# Altium schematic sheet 1.POWER2.5.SchDoc
size 431 x 304 mm
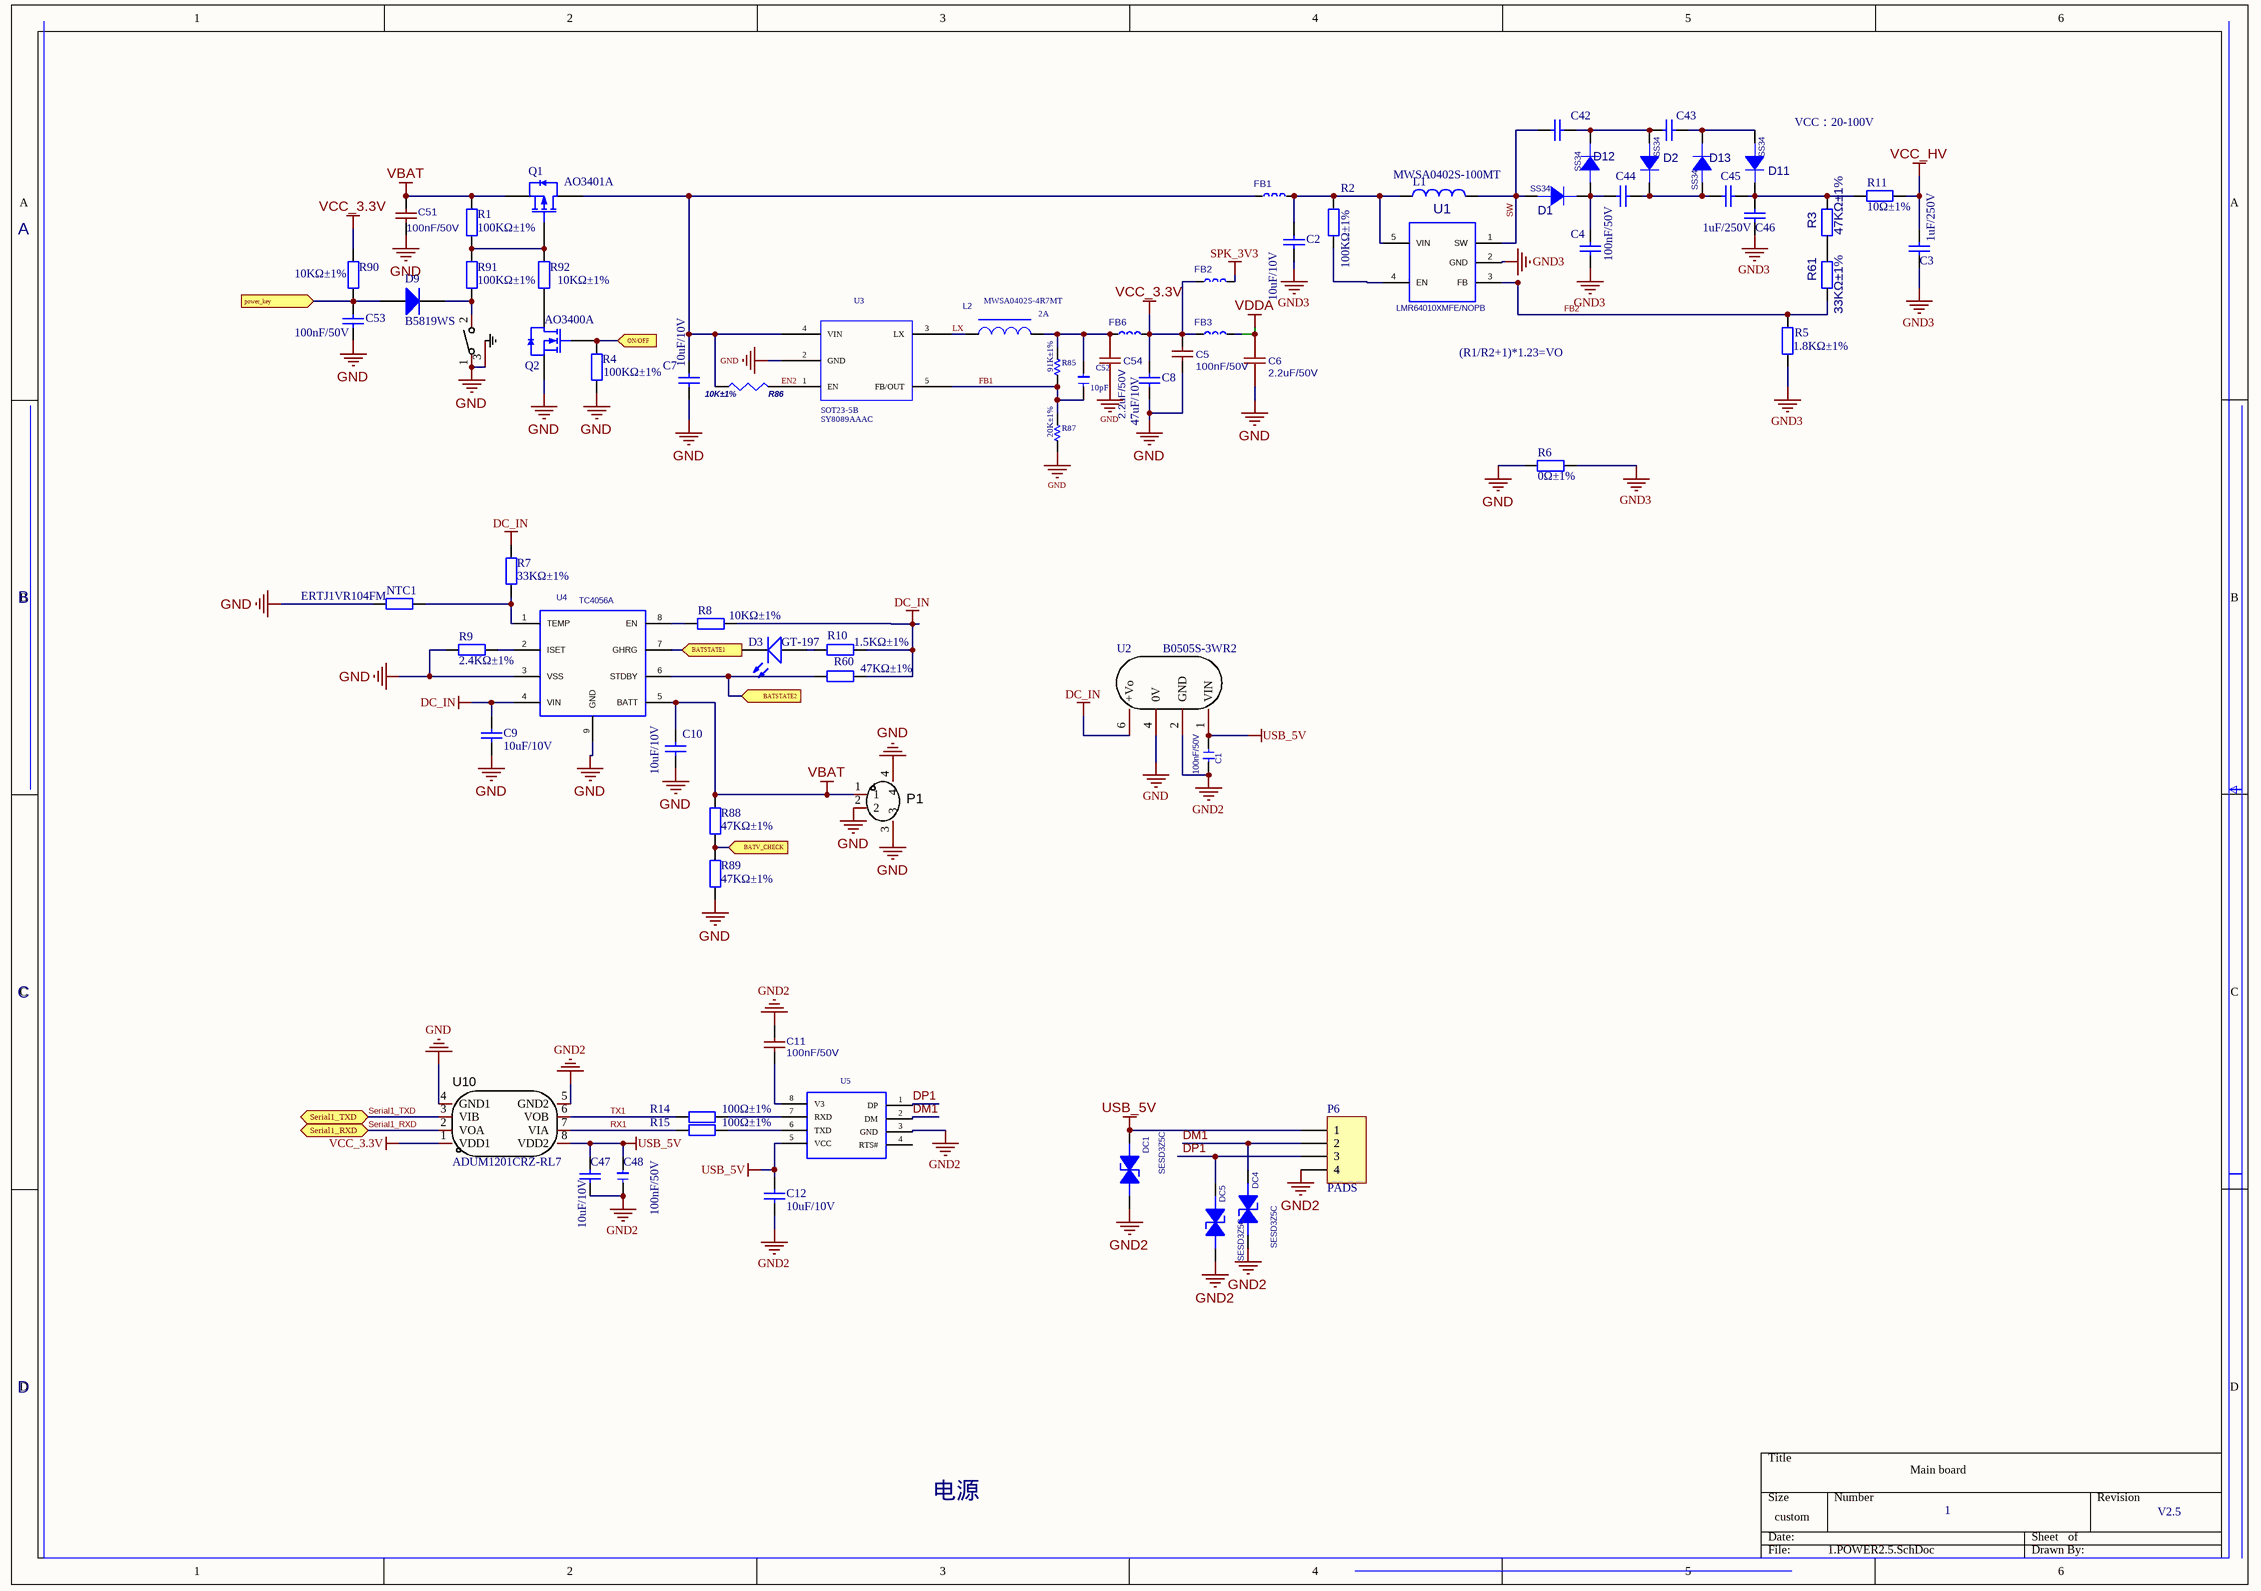
[diagram p0: 1.POWER2.5.SchDoc]

## Parts
C1  100nF/50V  [0402_C]
C2  10uF/10V  [0603C]
C3  1uF/250V  [1812_C]
C4  100nF/50V  [0603C]
C5  100nF/50V  [0603C]
C6  2.2uF/50V  [0603C]
C7  10uF/10V  [0603C]
C8  47uF/10V  [0805_C]
C9  10uF/10V  [0603C]
C10  10uF/10V  [0603C]
C11  100nF/50V  [0603C]
C12  10uF/10V  [0603C]
C42  CGA4J3X7T2E104MT0Y0N  [0805_C]  (value not drawn)
C43  CGA4J3X7T2E104MT0Y0N  [0805_C]  (value not drawn)
C44  CGA4J3X7T2E104MT0Y0N  [0805_C]  (value not drawn)
C45  CGA4J3X7T2E104MT0Y0N  [0805_C]  (value not drawn)
C46  1uF/250V  [1812_C]
C47  100nF/50V  [0603C]
C48  10uF/10V  [0603_C]
C51  100nF/50V  [0603C]
C52  10pF  [0603C]
C53  100nF/50V  [0603C]
C54  2.2uF/50V  [0603C]
D1  SS34  [SMA]
D2  value SS34  [SMA]  (hidden comment: SS2150)
D3  GT-197  [0603_LED_S1]
D9  B5819WS  [SOD-323]
D11  value SS34  [SMA]  (hidden comment: SS2150)
D12  value SS34  [SMA]  (hidden comment: SS2150)
D13  value SS34  [SMA]  (hidden comment: SS2150)
DC1  SESD3Z5C  [SOD323]
DC4  SESD3Z5C  [SOD323]
DC5  SESD3Z5C  [SOD323]
FB1  BLM18AG601SN1D  [R0603]  (value not drawn)
FB2  BLM18AG601SN1D  [R0603]  (value not drawn)
FB3  BLM18AG601SN1D  [R0603]  (value not drawn)
FB6  BLM18AG601SN1D  [R0603]  (value not drawn)
L1  MWSA0402S-100MT  [L-SMD-0420]
L2  Isat: 2A  [L-SMD-0420]  (hidden comment: MWSA0402S-4R7MT)
NTC1  ERTJ1VR104FM  [0603R]
P1  HX 1.25-2P WT  [1.25-2P]  (value not drawn)
P6  PADS  [CON4-4MM]
Q1  AO3401A  [SOT-23-3L]
Q2  AO3400A  [SOT-23-3L]
R1  100KΩ±1%  [0603R]
R2  100KΩ±1%  [0603R]
R3  47KΩ±1%  [0603R]
R4  100KΩ±1%  [0603R]
R5  1.8KΩ±1%  [0603R]
R6  0Ω±1%  [0603R]
R7  33KΩ±1%  [0603R]
R8  10KΩ±1%  [0603R]
R9  2.4KΩ±1%  [0603R]
R10  1.5KΩ±1%  [0603R]
R11  10Ω±1%  [0805_R]
R14  100Ω±1%  [0603R]
R15  100Ω±1%  [0603R]
R60  47KΩ±1%  [0603R]
R61  33KΩ±1%  [0603R]
R85  91K±1%  [0603R]
R86  10K±1%  [R0603]
R87  20K±1%  [0603R]
R88  47KΩ±1%  [0603R]
R89  47KΩ±1%  [0603R]
R90  10KΩ±1%  [0603R]
R91  100KΩ±1%  [0603R]
R92  10KΩ±1%  [0603R]
SW1  SKTDLHE010  [KEY_SKTDLHE010]  (value not drawn)
U1  LMR64010XMFE/NOPB  [SOT-23-5]
U2  B0505S-3WR2  [PWRM-TH_BXXXXS_SMD]
U3  value SY8089AAAC  PCB DECAL: SOT23-5B  [SOT-23-5]  (hidden comment: SY8089AAC)
U4  value TC4056A  [TC4056A]  (hidden comment: TP4056)
U5  CH340N  [SOP-8_150mil]  (value not drawn)
U10  ADUM1201CRZ-RL7  [SOP-8_150mil]

## Ports
BATSTATE1 (in), BATSTATE2 (in), BATV_CHECK (in), ON/OFF (in), power_key (in), Serial1_RXD (bidir), Serial1_TXD (bidir)

## Nets
DC_IN: C9.2 R7.2 R8.1 R10.2 R60.2 U2.6(+Vo) U4.4(VIN)
GND: C5.1 C6.1 C7.1 C8.1 C9.1 C10.1 C51.1 C53.2 C54.1 NTC1.1 P1.2 P1.3 P1.4 Q2.2(S) R4.2 R6.1 R9.1 R87.2 R89.1 SW1.1 SW1.3(GND) U2.4(0V) U3.2(GND) U4.3(VSS) U4.9(GND) U10.4(GND1)
GND2: C1.2 C11.1 C12.1 C47.2 C48.1 DC1.1(ANODE) DC4.1(ANODE) DC5.1(ANODE) P6.4 U2.2(GND) U5.3(GND) U10.5(GND2)
GND3: C2.2 C3.1 C4.1 C46.1 R5.1 R6.2 U1.2(GND)
SPK_3V3: FB2.2
USB_5V: C1.1 C12.2 C47.1 C48.2 DC1.2(CATHODE) P6.1 U2.1(VIN) U5.5(VCC) U10.8(VDD2)
VBAT: C10.2 C51.2 P1.1 Q1.2(S) R1.1 R88.2 U4.5(BATT)
VCC_3.3V: C5.2 C8.2 FB2.1 FB3.1 FB6.2 R90.1 U10.1(VDD1)
VCC_HV: C3.2 R11.2
VDDA: C6.2 FB3.2
BATSTATE1: D3.K U4.7(GHRG) ; port BATSTATE1
BATSTATE2: R60.1 U4.6(STDBY) ; port BATSTATE2
BATV_CHECK: R88.1 R89.2 ; port BATV_CHECK
DM1: DC4.2(CATHODE) P6.2 U5.2(DM)
DP1: DC5.2(CATHODE) P6.3 U5.1(DP)
EN2: R86.1 U3.1(EN)
FB1: C52.1 R85.2 R87.1 U3.5(FB/OUT)
FB2: R5.2 R61.2 U1.3(FB)
LX: L2.1 U3.3(LX)
ON/OFF: Q2.1(G) R4.1 ; port ON/OFF
power_key: C53.1 D9.1(A) R90.2 ; port power_key
RX1: R15.1 U10.7(VIA)
Serial1_RXD: U10.2(VOA) ; port Serial1_RXD
Serial1_TXD: U10.3(VIB) ; port Serial1_TXD
SW: C42.2 D1.1(A) L1.2 U1.1(SW)
TX1: R14.1 U10.6(VOB)
NetC2_1: C2.1 FB1.2 L1.1 R2.1 U1.5(VIN)
NetC4_2: C4.2 C44.1 D1.2(K) D12.1(A)
NetC7_2: C7.2 FB1.1 Q1.3(D) R86.2 U3.4(VIN)
NetC11_2: C11.2 U5.8(V3)
NetC42_1: C42.1 C43.1 D2.1(A) D12.2(K)
NetC43_2: C43.2 D11.1(A) D13.2(K)
NetC44_2: C44.2 C45.1 D2.2(K) D13.1(A)
NetC45_2: C45.2 C46.2 D11.2(K) R3.1 R11.1
NetC52_2: C52.2 C54.2 FB6.1 L2.2 R85.1
NetD3_A: D3.A R10.1
NetD9_2: D9.2(K) R91.2 SW1.2
NetNTC1_2: NTC1.2 R7.1 U4.1(TEMP)
NetQ1_1: Q1.1(G) R1.2 R91.1 R92.1
NetQ2_3: Q2.3(D) R92.2
NetR2_2: R2.2 U1.4(EN)
NetR3_2: R3.2 R61.1
NetR8_2: R8.2 U4.8(EN)
NetR9_2: R9.2 U4.2(ISET)
NetR14_2: R14.2 U5.7(RXD)
NetR15_2: R15.2 U5.6(TXD)

Not connected (* = marked no-connect by the designer): U5 4(RTS#)

## Notes on the sheet
- VCC：20-100V
- A
- (R1/R2+1)*1.23=VO
- B
- C
- D
- Main board
- 电源
- 1
- V2.5

## Library data of the parts
C1 = C0603: Part_Number: 99G12-000795; Part_Type: SMD CAP; DSCX: CAP ML 10 uF K 16V X5R SMT0805,THICKNESS=1.25mm EMK212BJ106KG-T TAIYO; Dsc7: EMK212BJ106KG-T; ID: 16409; FFNQ: CAP ML 10 uF K 16V X5R SMT0805; approval_status: A; Dsc1: CAP ML; Dsc2: 10uF; Dsc3: K; Dsc4: 16V; Dsc5: X5R; Dsc6: SMT0805,THICKNESS=1.25mm; Dsc8: TAIYO; Qualify: YES; QUAN: 3078; Source_Path: D:\VSYMB\CAP.OLB; Value: 0.1uF; Cost: 0.03; PCB DECAL: C0603; Date: 12302002
C2 C9 C10 C12 = 0603 10uF (106) 10% 10V: 贴片电容; ComponentLink1Description: 供应商链接; ComponentLink1URL: http://www.szlcsc.com/product/details_20411.html; Package: 0603; Supplier: LC; SuppliersPartNumber: C19702
C3 = Cap: Capacitor 1uF/250V  FS43X105K251EGG; Value: 100pF; Published: 8-Jun-2000; LatestRevisionDate: 17-Jul-2002; LatestRevisionNote: Re-released for DXP Platform.; PackageReference: RAD-0.3; Publisher: Altium Limited; PackageDescription: Radial Cap, Thru-Hole; 2 Leads; 0.3 in Pin Spacing
C4 = Cap: Capacitor 100nF/50V; Value: 100pF; Published: 8-Jun-2000; LatestRevisionDate: 17-Jul-2002; LatestRevisionNote: Re-released for DXP Platform.; PackageReference: RAD-0.3; Publisher: Altium Limited; PackageDescription: Radial Cap, Thru-Hole; 2 Leads; 0.3 in Pin Spacing
C5 C11 C51 = 100nF: BOM_Manufacturer Part: CL05B104KO5NNNC; BOM_Manufacturer: SAMSUNG; nameAlias: Capacitance; SMT Type: Basic; BOM_Supplier: LCSC; BOM_LCSC Assembly: Yes; BOM_Supplier Part: C1525; spicePre: C; spiceSymbolName: CL05B104KO5NNNC
C6 C54 = 1uF: BOM_Manufacturer: SAMSUNG; BOM_Manufacturer Part: CL05A105KA5NQNC; nameAlias: Capacitance; SMT Type: Basic; BOM_Supplier: LCSC; BOM_LCSC Assembly: Yes; BOM_Supplier Part: C52923; spicePre: C; spiceSymbolName: CL05A105KA5NQNC
C7 C8 = 0603 2.2uF (225) 10% 16V: 贴片电容; ComponentLink1Description: 供应商链接; ComponentLink1URL: http://www.szlcsc.com/product/details_24366.html; Package: 0603; Supplier: LC; SuppliersPartNumber: C23630
C42-C45 = Cap: 100nF 精度：±20% 额定电压：250V; Value: 100pF; Published: 8-Jun-2000; LatestRevisionDate: 17-Jul-2002; LatestRevisionNote: Re-released for DXP Platform.; PackageReference: RAD-0.3; Publisher: Altium Limited; PackageDescription: Radial Cap, Thru-Hole; 2 Leads; 0.3 in Pin Spacing
C46 = Cap: Capacitor 1uF/250V FS43X105K251EGG; Value: 100pF; Published: 8-Jun-2000; LatestRevisionDate: 17-Jul-2002; LatestRevisionNote: Re-released for DXP Platform.; PackageReference: RAD-0.3; Publisher: Altium Limited; PackageDescription: Radial Cap, Thru-Hole; 2 Leads; 0.3 in Pin Spacing
C47 C53 = 0402 100nF (104) 10% 16V: 贴片电容100nF 10% 50V; ComponentLink1Description: 供应商链接; ComponentLink1URL: http://www.szlcsc.com/product/details_1877.html; Package: 0402; Supplier: LC; SuppliersPartNumber: C1525
C48 = C0603: Part_Number: 99G12-000795; Part_Type: SMD CAP; DSCX: CAP ML 10 uF K 16V X5R SMT0805,THICKNESS=1.25mm EMK212BJ106KG-T TAIYO; Dsc7: EMK212BJ106KG-T; ID: 16409; FFNQ: CAP ML 10 uF K 16V X5R SMT0805; approval_status: A; Dsc1: CAP ML; Dsc2: 10uF; Dsc3: K; Dsc4: 16V; Dsc5: X5R; Dsc6: SMT0805,THICKNESS=1.25mm; Dsc8: TAIYO; Qualify: YES; QUAN: 3078; Source_Path: D:\VSYMB\CAP.OLB; Value: 10uF; Cost: 0.03; PCB DECAL: C0603; Date: 12302002
C52 = C: Part_Number: 99G12-000795; Part_Type: SMD CAP; DSCX: CAP ML 10 uF K 16V X5R SMT0805,THICKNESS=1.25mm EMK212BJ106KG-T TAIYO; Dsc7: EMK212BJ106KG-T; ID: 16409; FFNQ: CAP ML 10 uF K 16V X5R SMT0805; approval_status: A; Dsc1: CAP ML; Dsc3: K; Dsc4: 16V; Dsc5: X5R; Dsc6: SMT0805,THICKNESS=1.25mm; Dsc8: TAIYO; Qualify: YES; QUAN: 3078; PCB DECAL: CAP0805; Source_Path: D:\VSYMB\CAP.OLB; Dsc2: 10pF; Cost: 0.03; Value: 10pF; Date: 12302002
D1 = DIODE_2: Schottky Barrier， DO214AA; Manufacturer: 星海; Part_Type: Schottky rectifier; Created_by: JJJ; Priority: 3A; PCB DECAL: DO-214AC; Source_Path: E:\2017\VIDEO MEETING\RK3399_VR&TABLET_V13_20170614\RK3399_VR&TABLET_V13_20170614-162.DSN; Manufacturer_PN: DO214AA; RK_PN: SS34; Value: SS34
D2 D11-D13 = DIODE_2: SS2150 150V SMA(DO-214AC); Manufacturer_PN: DO214AA; Manufacturer: 星海; Part_Type: Schottky rectifier; Created_by: JJJ; Priority: 3A; Source_Path: E:\2017\VIDEO MEETING\RK3399_VR&TABLET_V13_20170614\RK3399_VR&TABLET_V13_20170614-162.DSN; RK_PN: SS34; PCB DECAL: DO-214AC
D3 = 0603 白灯: EVERLIGHT(亿光) GT-197   0603; ComponentLink1Description: 供应商链接; ComponentLink1URL: http://www.szlcsc.com/product/details_2663.html; Package: 0603; Supplier: LC; SuppliersPartNumber: C2290
D9 = Diode: CJ(江苏长电/长晶); Published: 8-Jun-2000; LatestRevisionDate: 17-Jul-2002; LatestRevisionNote: Re-released for DXP Platform.; PackageVersion: Sep-1996; PackageReference: SMC; Publisher: Altium Limited; PackageDescription: DO-214-AB/SMC; 2 C-Bend Leads; Body 7.9 x 5.9 mm, inc. leads (LxW); Code_JEDEC: DO-214-AB
DC1 DC4 DC5 = ESD5451X_Dup1: ID: DE-E0004; Parameter: ESD0402
FB1-FB3 FB6 = ZXC: 磁珠/600Ω@100MHz ±25% BLM18AG601SN1D 0603; Value: 200R/1A; PCB DECAL: R0603
L1 = Inductor: Sunlord MWSA0402S-100MT 10uH/2.2A; Code_IEC: 1005; Value: 10mH; Published: 8-Jun-2000; LatestRevisionDate: 29-May-2009; LatestRevisionNote: IPC-7351 Footprint Added.; PackageReference: 0402-A; Publisher: Altium Limited; PackageDescription: Chip Inductor; Code_JEITA: 0402
L2 = L: Power Inductor,10uH,0.2,IND_303015; Part_Type: POWER_IND; Manufacturer: sunlord; PCB DECAL: SMD_4.45X4.2; RK_PN: SWPA3015S3R3MT; Priority: A; DC_Resistor: 0.08ohm; Tolerance: 20%; Resonace_frequency: 68M; Created_by: YTL; Source_Path: Z:\RK_STANDARD_LIBRARY\CADENCE_CIS\RK_DISCRETE.OLB; Irms: 2A; Manufacturer_PN: SWPA3015S3R3MT; Value: MWSA0402S-4R7MT
NTC1 R9 = 0603 1.8KΩ (1801) 1%: 贴片电阻; ComponentLink1Description: 供应商链接; ComponentLink1URL: http://www.szlcsc.com/product/details_4584.html; Package: 0603; Supplier: LC; SuppliersPartNumber: C4177
P1 = HX 1.25-2P WT: Manufacturer: hanxia(韩下); Add into BOM: yes; Name: HX 1.25-2P WT; Symbol: HX 1.25-2P WT; Device: HX 1.25-2P WT; LCSC Part Name: AWR 1.25卧贴针座 1.25mm间距2Pin卧式贴片; Supplier Part: C5142069; Manufacturer Part: HX 1.25-2P WT; Supplier Footprint: SMD,P=1.25mm; JLCPCB Part Class: Extended Part; Datasheet: https://atta.szlcsc.com/upload/public/pdf/source/20220818/902167240A14414EBE70E0F5623727B7.pdf; Supplier: LCSC; Convert to PCB: yes
P6 = Header 4: Header, 4-Pin; LatestRevisionDate: 17-Jul-2002; LatestRevisionNote: Re-released for DXP Platform.; Publisher: Altium Limited
Q1 = AO3401A P道沟 X13A15 SOT-23: MOS(场效应管); ComponentLink1Description: 供应商链接; ComponentLink1URL: http://www.szlcsc.com/product/details_15801.html; Package: SOT-23; Supplier: LC; SuppliersPartNumber: C15127
Q2 = AO3400A N道沟 X0YV1T SOT-23: MOS(场效应管); ComponentLink1Description: 供应商链接; ComponentLink1URL: http://www.szlcsc.com/product/details_21629.html; Package: SOT-23; Supplier: LC; SuppliersPartNumber: C20917
R1 R2 R8 R88-R92 = 0402 10KΩ (1002) 1%: 贴片电阻; ComponentLink1Description: 供应商链接; ComponentLink1URL: http://www.szlcsc.com/product/details_26487.html; Package: 0402; Supplier: LC; SuppliersPartNumber: C25744
R3 R61 = RES2: Resistor; Value: 100R; PCB DECAL: 0603_R; Published: 8-Jun-2000; LatestRevisionDate: 17-Jul-2002; LatestRevisionNote: Re-released for DXP Platform.; PackageReference: AXIAL-0.4; Publisher: Altium Limited
R4 = 0402 1KΩ (1001) 1%: 贴片电阻; ComponentLink1Description: 供应商链接; ComponentLink1URL: http://www.szlcsc.com/product/details_12256.html; Package: 0402; Supplier: LC; SuppliersPartNumber: C11702
R5 = 0603 5.1KΩ (5101) 1%: 贴片电阻; ComponentLink1Description: 供应商链接; ComponentLink1URL: http://www.szlcsc.com/product/details_23913.html; Package: 0603; Supplier: LC; SuppliersPartNumber: C23186
R6 R11 = 0603 0Ω (0R0) 1%: 贴片电阻; ComponentLink1Description: 供应商链接; ComponentLink1URL: http://www.szlcsc.com/product/details_21903.html; Package: 0603; Supplier: LC; SuppliersPartNumber: C21189
R7 R10 R60 = 0402 1.5KΩ (1501) 1%: 贴片电阻; ComponentLink1Description: 供应商链接; ComponentLink1URL: http://www.szlcsc.com/product/details_26610.html; Package: 0402; Supplier: LC; SuppliersPartNumber: C25867
R14 R15 = 0603 100Ω (1000) 1%: 贴片电阻; ComponentLink1Description: 供应商链接; ComponentLink1URL: http://www.szlcsc.com/product/details_23502.html; Package: 0603; Supplier: LC; SuppliersPartNumber: C22775
R85 R87 = R: PCB DECAL: 0603R
  R85: value: 91K±1%
  R87: Value: 20K±1%
R86 = RES1: Source_Path: C:\WINORCAD\CAPTURE\LIBRARY\DISCRETE.OLB; PCB DECAL: R0603; Value: 10K±1%; Assembly: R0603
SW1 = SKTDLHE010: KEY-SMD_SKTDLHE010; Manufacturer: ALPSALPINE(阿尔卑斯阿尔派); Add into BOM: yes; Circuit: 单刀单掷; Actuator Style: 矩形按钮; Name: SKTDLHE010; Symbol: SKTDLHE010; Device: SKTDLHE010; LCSC Part Name: SKTDLHE010; Supplier Part: C380198; Manufacturer Part: SKTDLHE010; Supplier Footprint: SMD; JLCPCB Part Class: Extended Part; Datasheet: https://atta.szlcsc.com/upload/public/pdf/source/20200409/C380198_178C729B1AFCBF15D3CDD9052567B65D.pdf; Supplier: LCSC; Convert to PCB: yes; Mounting Style: 卧贴; With Lamp: -
U1 = LMR64010XMFE/NOPB: Manufacturer: Silergy（矽力杰）; Part_Type: DCDC; PCB DECAL: SOT23-5B; Created_by: JJJ; Priority: A; Option: /CE8513B-1A/PT3406/PT3409A/B; Source_Path: Z:\RK_STANDARD_LIBRARY\CADENCE_CIS\RK_IC.OLB; Manufacturer_PN: LMR64010XMFE/NOPB; RK_PN: LMR64010XMFE/NOPB; Value: LMR64010XMFE/NOPB
U2 = B0505S-2WR2_C41613: 转换类型:DC-DC;输出路数:1;输入电压(DC):4.5V~5.5V;输出电压:5V;输出电流(最大值):400mA;输出功率:2W;转换效率:89%;; Manufacturer: MORNSUN(金升阳); Add into BOM: yes; Conversion Type: DC-DC; Output Channel: 1; Output Voltage: 5V; Output Current (Max): 400mA; Output Power: 2W; Conversion Efficiency: 89%; Name: B0505S-2WR2; Symbol: B0505S-2WR2; Device: B0505S-2WR2_C41613; LCSC Part Name: Vin=4.5V~5.5V Vout=5V 400mA; Supplier Part: C41613; Manufacturer Part: B0505S-2WR2; Supplier Footprint: 插件; JLCPCB Part Class: 扩展库; Datasheet: https://atta.szlcsc.com/upload/public/pdf/source/20150124/1457707262078.pdf; Supplier: LCSC; Convert to PCB: yes; Function: -; Input Voltage(DC): 4.5V~5.5V
U3 = DCDC_SY8088: Manufacturer: Silergy（矽力杰）; Part_Type: DCDC; Created_by: JJJ; Priority: A; Option: /CE8513B-1A/PT3406/PT3409A/B; Source_Path: Z:\RK_STANDARD_LIBRARY\CADENCE_CIS\RK_IC.OLB; Manufacturer_PN: SY8089AAC; RK_PN: SY8089AAC
U4 = CT4056A: 开关电源 SOP-8E封装; Part Number: 03-; PCB DECAL: ESOP_8; Geometry.Height: 1.27000mm
U5 = CH340N: PCB DECAL: SOP8; Value: CH340N
U10 = ADUM1201CRZ-RL7: Manufacturer: ADI(亚德诺)/LINEAR(凌特); Add into BOM: yes; Isolation Technology: General Purpose; Voltage Isolation or Not: No; Name: ADUM1201CRZ-RL7; Symbol: ADUM1201CRZ-RL7; Device: ADUM1201CRZ-RL7; LCSC Part Name: ADUM1201CRZ-RL7; Supplier Part: C107672; Manufacturer Part: ADUM1201CRZ-RL7; Supplier Footprint: SOIC-8-150mil; JLCPCB Part Class: Extended Part; Datasheet: https://atta.szlcsc.com/upload/public/pdf/source/20171116/C107672_15108220974131123665.pdf; Supplier: LCSC; Convert to PCB: yes; Applications: Magnetic Coupling